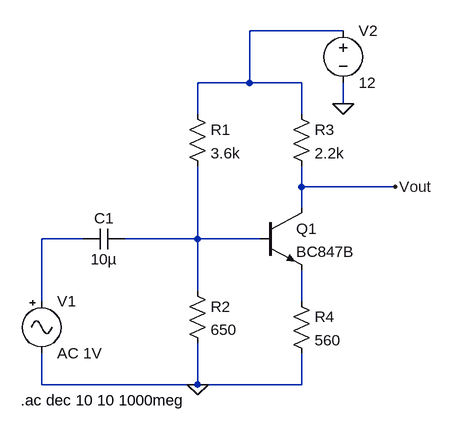
[diagram p0: schematic feedback 1.asc]
feedback 1.asc, the LTspice schematic file:
Version 4
SHEET 1 880 680
WIRE 320 -128 176 -128
WIRE 176 -48 176 -128
WIRE 176 -48 96 -48
WIRE 256 -48 176 -48
WIRE 320 -16 320 -48
WIRE 96 0 96 -48
WIRE 256 0 256 -48
WIRE 256 112 256 80
WIRE 400 112 256 112
WIRE 256 144 256 112
WIRE -80 192 -144 192
WIRE 96 192 96 80
WIRE 96 192 -16 192
WIRE 192 192 96 192
WIRE 96 272 96 192
WIRE -144 288 -144 192
WIRE 256 288 256 240
WIRE -144 416 -144 368
WIRE 96 416 96 352
WIRE 96 416 -144 416
WIRE 256 416 256 368
WIRE 256 416 96 416
FLAG 320 -16 0
FLAG 96 416 0
FLAG 400 112 Vout
SYMBOL npn 192 144 R0
SYMATTR InstName Q1
SYMATTR Value BC847B
SYMBOL res 80 -16 R0
SYMATTR InstName R1
SYMATTR Value 3.6k
SYMBOL res 80 256 R0
SYMATTR InstName R2
SYMATTR Value 650
SYMBOL res 240 -16 R0
SYMATTR InstName R3
SYMATTR Value 2.2k
SYMBOL res 240 272 R0
SYMATTR InstName R4
SYMATTR Value 560
SYMBOL cap -16 176 R90
WINDOW 0 0 32 VBottom 2
WINDOW 3 32 32 VTop 2
SYMATTR InstName C1
SYMATTR Value 10µ
SYMBOL voltage 320 -144 R0
WINDOW 123 0 0 Left 0
WINDOW 39 0 0 Left 0
SYMATTR InstName V2
SYMATTR Value 12
SYMBOL Misc\\signal -144 272 R0
SYMATTR InstName V1
SYMATTR Value AC 1V
TEXT -176 440 Left 2 !.ac dec 10 10 1000meg

The netlist it stands for:
* feedback 1.asc
Q1 Vout N003 N004 0 BC847B
R1 N001 N003 3.6k
R2 N003 0 650
R3 N001 Vout 2.2k
R4 N004 0 560
C1 N003 N002 10µ
V2 N001 0 12
V1 N002 0 AC 1V
.model NPN NPN
.model PNP PNP
.lib standard.bjt
.ac dec 10 10 1000meg
.backanno
.end